# Altium schematic sheet Sheet5.SchDoc
size A4
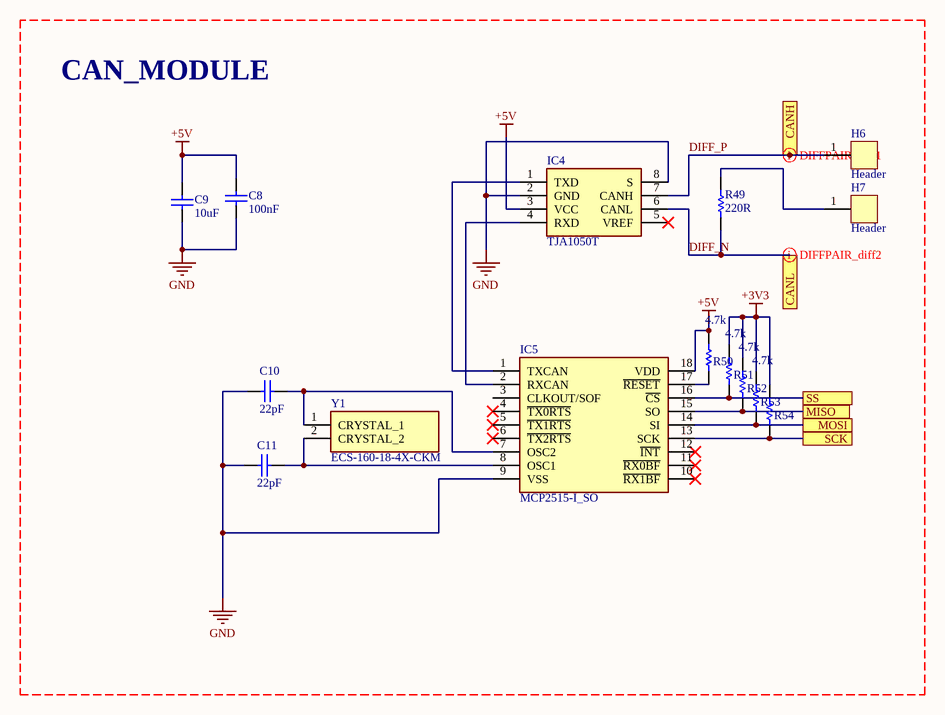
[diagram p0: Sheet5.SchDoc]

## Parts
C8  100nF  [KEMT-1206-2_N]
C9  10uF  [KEMT-1206-2_N]
C10  22pF  [KEMT-1206-2_N]
C11  22pF  [KEMT-1206-2_N]
H6  Header  [Header]
H7  Header  [Header]
IC4  TJA1050T  [SOIC127P600X175-8N]
IC5  MCP2515-I_SO  [SOIC127P1030X265-18N]
R49  220R  [R1206]
R50  4.7k  [R1206]
R51  4.7k  [R1206]
R52  4.7k  [R1206]
R53  4.7k  [R1206]
R54  4.7k  [R1206]  (value not drawn)
Y1  ECS-160-18-4X-CKM  [ECS160184XCKM]

## Blocks framed on the sheet
CAN_MODULE: C8-C11 H6 H7 IC4 IC5 R49-R54 Y1

## Ports
CANH, CANL, MISO, MOSI, SCK, SS

## Nets
+3V3: R51.1 R52.1 R53.1 R54.1
+5V: C8.1 C9.1 IC4.3(VCC) IC5.18(VDD) R50.1
GND: C8.2 C9.2 C10.2 C11.2 IC4.2(GND) IC4.8(S) IC5.9(VSS)
DIFF_N: IC4.6(CANL) R49.1 ; port CANL
DIFF_P: H6.1 IC4.7(CANH) ; port CANH
MISO: IC5.15(SO) R52.2 ; port MISO
MOSI: IC5.14(SI) R53.2 ; port MOSI
SCK: IC5.13(SCK) R54.2 ; port SCK
SS: IC5.16(~{CS}) R51.2 ; port SS
NetC10_1: C10.1 IC5.7(OSC2) Y1.1(CRYSTAL_1)
NetC11_1: C11.1 IC5.8(OSC1) Y1.2(CRYSTAL_2)
NetH7_1: H7.1 R49.2
NetIC4_1: IC4.1(TXD) IC5.1(TXCAN)
NetIC4_4: IC4.4(RXD) IC5.2(RXCAN)
NetIC5_17: IC5.17(~{RESET}) R50.2

Not connected (* = marked no-connect by the designer): IC4 5(VREF)*; IC5 3(CLKOUT/SOF) 4(~{TX0RTS})* 5(~{TX1RTS})* 6(~{TX2RTS})* 10(~{RX1BF})* 11(~{RX0BF})* 12(~{INT})*

## Layout directives
differential pair; differential pair class *: DIFF_N, DIFF_P

## Library data of the parts
C8-C11 = CMP-1037-04202-2: CAP, Ceramic, 0.1 uF, +/- 10%, 50 V, -55 to 125 degC, 1206 (3216 Metric), RoHS, Tape and Reel; Manufacturer: Kemet; Voltage Rating: 50V; Capacitance: 0.1µF; Product Range: KEMET-CSeries; SVHC: ToBeAdvised; Dielectric Characteristic: X7R; Capacitor Case Style: 1206[3216Metric]; Package Reference: 1206-2; Package Description: 2-Leads SMD, Body 3.2 x 1.6 mm; Packaging: Tape&Reel; Operating Temperature Max: 125degC; Capacitance Tolerance: ±10%; Datasheet URL: https://datasheet.ciiva.com/6125/1725438-6125494.pdf; Manufacturer URL: http://www.kemet.com/; Operating Temperature Min: -55degC; Datasheet Version: Jul-13
IC4 = TJA1050T: Integrated Circuit; Manufacturer_Name: Nexperia; Datasheet Link: http://docs-emea.rs-online.com/webdocs/0425/0900766b80425301.pdf; Height: 1.75mm; Manufacturer_Part_Number: TJA1050T; Mouser Part Number: N/A; Mouser Price/Stock: https://www.mouser.com/Search/Refine.aspx?Keyword=N%2FA
IC5 = MCP2515-I_SO: Integrated Circuit; Manufacturer_Name: Microchip; Manufacturer_Part_Number: MCP2515-I/SO; Datasheet Link: http://ww1.microchip.com/downloads/en/DeviceDoc/21801G.pdf; Height: 2.65mm; Mouser Part Number: 579-MCP2515-I/SO; Mouser Price/Stock: https://www.mouser.co.uk/ProductDetail/Microchip-Technology/MCP2515-I-SO?qs=KwArPi4cUogGDbGnphOvtQ%3D%3D; Arrow Part Number: MCP2515-I/SO; Arrow Price/Stock: https://www.arrow.com/en/products/mcp2515-iso/microchip-technology?region=nac
R49-R54 = RES: Part Number: CRCW120647K0FKEA; Manufacturer: Vishay Dale
Y1 = ECS-160-18-4X-CKM: Crystal or Oscillator; Manufacturer_Name: ECS; Datasheet Link: https://www.mouser.be/datasheet/2/122/hc-49usx-791.pdf; Height: 3.5mm; Manufacturer_Part_Number: ECS-160-18-4X-CKM; Mouser Part Number: 520-ECS160-18-4X-CKM; Mouser Price/Stock: https://www.mouser.co.uk/ProductDetail/ECS/ECS-160-18-4X-CKM?qs=7MVldsJ5UawYqyimirccKw%3D%3D